# EAGLE design Maker Faire Machine Panel4 (Electron) (EAGLE 7.5.0)
DATABASE: /home/monkbroc/Electronics/eagle/PARTSDB.tsv
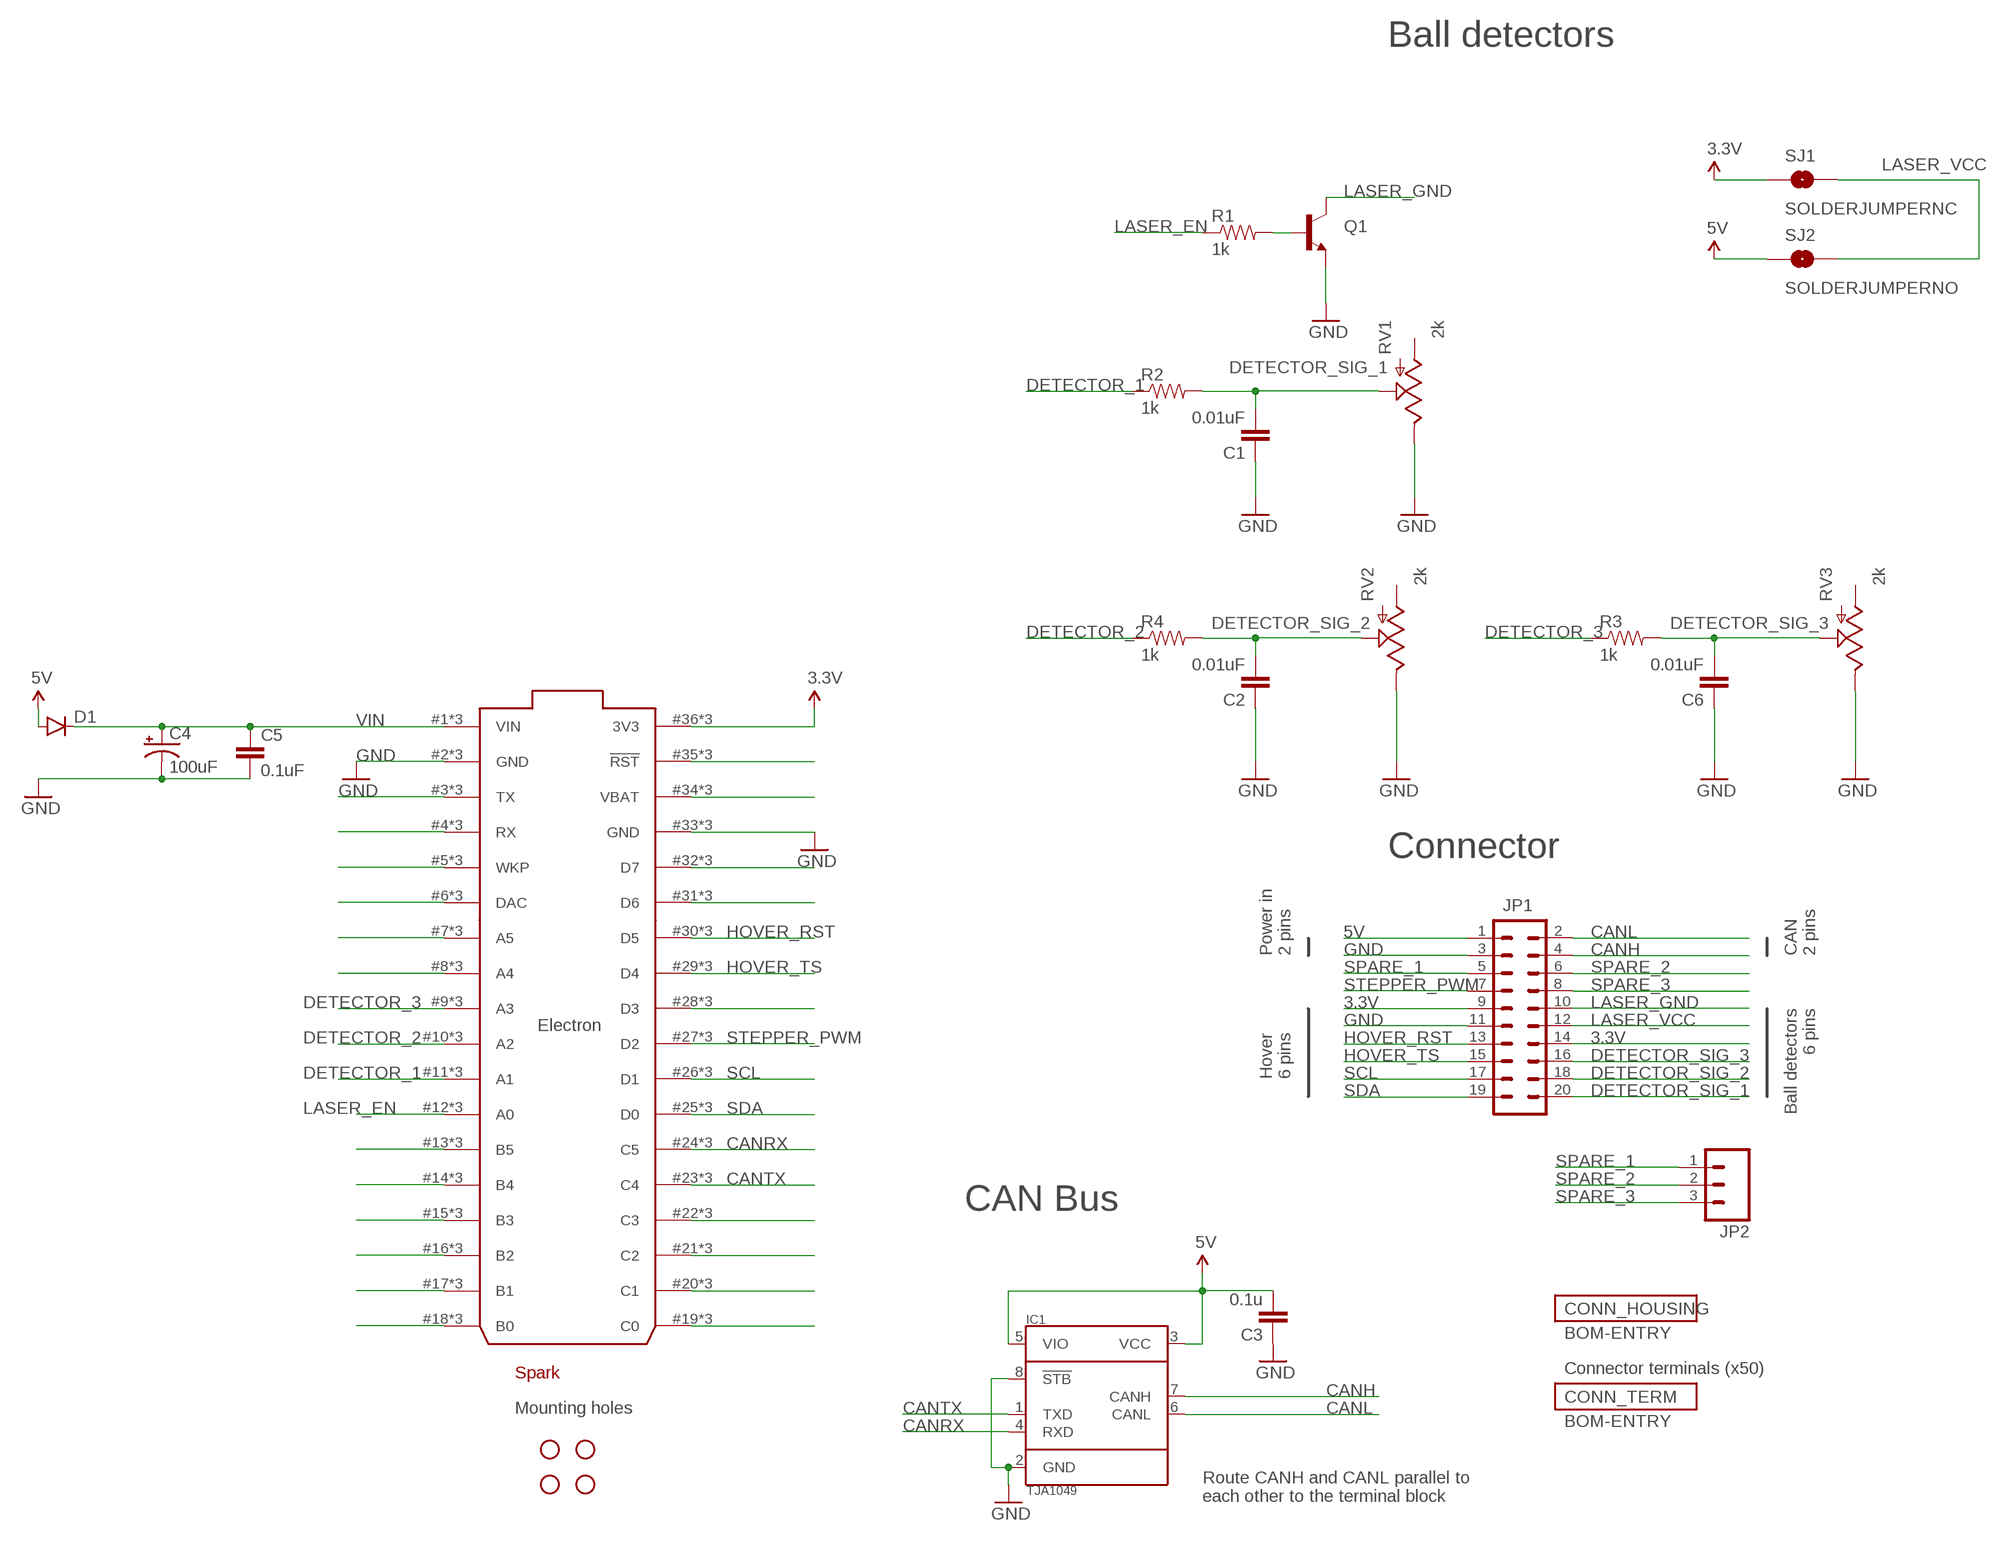
[diagram p0: schematic, sheet 1]
CONN_HOUSING (BOM-ENTRY): DESC: Connector housing; PARTNO: 334722001
CONN_TERM (BOM-ENTRY): DESC: Connector terminals (x50); PARTNO: 330122002

## Parts
C1  0.01uF  CAP1206  [1206]
C2  0.01uF  CAP1206  [1206]
C3  0.1u  CAP1206  [1206]
C4  100uF  CAP_POLPTH1  [CPOL-RADIAL-100UF-25V]
C5  0.1uF  CAP1206  [1206]
C6  0.01uF  CAP1206  [1206]
D1  DIODESMA  [SMA-DIODE]
ELECTRON  ELECTRON_WITH_STACKABLE_HEADERS  [ELECTRON_STACKABLE]
IC1  TJA1049  [SO8]
JP1  M10X2_MMOLEX_MX150  [2X10_MOLEX_MX150]
JP2  M031X03_NO_SILK  [1X03_NO_SILK]
Q1  TRANSISTOR_NPNTO-92-AMMO  [TO-92-AMMO]
R1  1k  RESISTOR1206  [1206]
R2  1k  RESISTOR1206  [1206]
R3  1k  RESISTOR1206  [1206]
R4  1k  RESISTOR1206  [1206]
RV1  2k  POT100K_3362U  [3362U]
RV2  2k  POT100K_3362U  [3362U]
RV3  2k  POT100K_3362U  [3362U]
SJ1  SOLDERJUMPERNC  [SJ_2S]
SJ2  SOLDERJUMPERNO  [SJ_2S-NO]
STANDOFF1  STAND-OFF  [STAND-OFF]
STANDOFF2  STAND-OFF  [STAND-OFF]
STANDOFF3  STAND-OFF  [STAND-OFF]
STANDOFF4  STAND-OFF  [STAND-OFF]
U$2  SPARK_LOGOSILK  [SPARK_LOGO_SILK]

## Nets
3.3V: ELECTRON.36(3V3) ELECTRON.#36(3V3) ELECTRON.@36(3V3) JP1.9 JP1.14 SJ1.1
5V: C3.2 D1.A IC1.3(VCC) IC1.5(VIO) JP1.1 SJ2.1
CANH: IC1.7(CANH) JP1.4
CANL: IC1.6(CANL) JP1.2
CANRX: ELECTRON.24(C5) ELECTRON.#24(C5) ELECTRON.@24(C5) IC1.4(RXD)
CANTX: ELECTRON.23(C4) ELECTRON.#23(C4) ELECTRON.@23(C4) IC1.1(TXD)
DETECTOR_1: ELECTRON.11(A1) ELECTRON.#11(A1) ELECTRON.@11(A1) R2.1
DETECTOR_2: ELECTRON.10(A2) ELECTRON.#10(A2) ELECTRON.@10(A2) R4.1
DETECTOR_3: ELECTRON.9(A3) ELECTRON.#9(A3) ELECTRON.@9(A3) R3.1
DETECTOR_SIG_1: C1.2 JP1.20 R2.2 RV1.P$2(S)
DETECTOR_SIG_2: C2.2 JP1.18 R4.2 RV2.P$2(S)
DETECTOR_SIG_3: C6.2 JP1.16 R3.2 RV3.P$2(S)
GND: C1.1 C2.1 C3.1 C4.2(-) C5.2 C6.1 ELECTRON.2(GND) ELECTRON.33(GND) ELECTRON.#2(GND) ELECTRON.#33(GND) ELECTRON.@2(GND) ELECTRON.@33(GND) IC1.2(GND) IC1.8(!STB) JP1.3 JP1.11 Q1.1(E) RV1.P$1(E) RV2.P$1(E) RV3.P$1(E)
HOVER_RST: ELECTRON.30(D5) ELECTRON.#30(D5) ELECTRON.@30(D5) JP1.13
HOVER_TS: ELECTRON.29(D4) ELECTRON.#29(D4) ELECTRON.@29(D4) JP1.15
LASER_EN: ELECTRON.12(A0) ELECTRON.#12(A0) ELECTRON.@12(A0) R1.1
LASER_GND: JP1.10 Q1.3(C)
LASER_VCC: JP1.12 SJ1.2 SJ2.2
N$1: ELECTRON.35(!RST) ELECTRON.#35(!RST) ELECTRON.@35(!RST)
N$2: ELECTRON.34(VBAT) ELECTRON.#34(VBAT) ELECTRON.@34(VBAT)
N$3: Q1.2(B) R1.2
N$5: ELECTRON.32(D7) ELECTRON.#32(D7) ELECTRON.@32(D7)
N$6: ELECTRON.31(D6) ELECTRON.#31(D6) ELECTRON.@31(D6)
N$7: ELECTRON.28(D3) ELECTRON.#28(D3) ELECTRON.@28(D3)
N$8: ELECTRON.8(A4) ELECTRON.#8(A4) ELECTRON.@8(A4)
N$9: ELECTRON.7(A5) ELECTRON.#7(A5) ELECTRON.@7(A5)
N$10: ELECTRON.6(DAC) ELECTRON.#6(DAC) ELECTRON.@6(DAC)
N$11: ELECTRON.5(WKP) ELECTRON.#5(WKP) ELECTRON.@5(WKP)
N$12: ELECTRON.4(RX) ELECTRON.#4(RX) ELECTRON.@4(RX)
N$13: ELECTRON.3(TX) ELECTRON.#3(TX) ELECTRON.@3(TX)
N$14: ELECTRON.22(C3) ELECTRON.#22(C3) ELECTRON.@22(C3)
N$15: ELECTRON.21(C2) ELECTRON.#21(C2) ELECTRON.@21(C2)
N$16: ELECTRON.20(C1) ELECTRON.#20(C1) ELECTRON.@20(C1)
N$17: ELECTRON.19(C0) ELECTRON.#19(C0) ELECTRON.@19(C0)
N$18: ELECTRON.18(B0) ELECTRON.#18(B0) ELECTRON.@18(B0)
N$19: ELECTRON.17(B1) ELECTRON.#17(B1) ELECTRON.@17(B1)
N$20: ELECTRON.16(B2) ELECTRON.#16(B2) ELECTRON.@16(B2)
N$21: ELECTRON.15(B3) ELECTRON.#15(B3) ELECTRON.@15(B3)
N$22: ELECTRON.14(B4) ELECTRON.#14(B4) ELECTRON.@14(B4)
N$23: ELECTRON.13(B5) ELECTRON.#13(B5) ELECTRON.@13(B5)
SCL: ELECTRON.26(D1) ELECTRON.#26(D1) ELECTRON.@26(D1) JP1.17
SDA: ELECTRON.25(D0) ELECTRON.#25(D0) ELECTRON.@25(D0) JP1.19
SPARE_1: JP1.5 JP2.1
SPARE_2: JP1.6 JP2.2
SPARE_3: JP1.8 JP2.3
STEPPER_PWM: ELECTRON.27(D2) ELECTRON.#27(D2) ELECTRON.@27(D2) JP1.7
VIN: C4.1(+) C5.1 D1.C ELECTRON.1(VIN) ELECTRON.#1(VIN) ELECTRON.@1(VIN)
Unconnected: RV1.P$3(A) RV2.P$3(A) RV3.P$3(A)

## Notes on the sheet
- Ball detectors
- Connector
- Power in
  2 pins
- CAN
  2 pins
- Ball detectors
  6 pins
- Hover
  6 pins
- CAN Bus
- Mounting holes
- Route CANH and CANL parallel to
  each other to the terminal block

## Library data of the parts
C1 C2 C6 = SparkFun-Passives:CAP: Capacitor Standard 0603 ceramic capacitor, and 0.1" leaded capacitor.; PARTNO: 12065C103KAT2A
C3 C5 = SparkFun-Capacitors:CAP: Capacitor Standard 0603 ceramic capacitor, and 0.1" leaded capacitor.; PARTNO: 12065C104KAT2A
C4 = SparkFun-Capacitors:CAP_POL: Capacitor Polarized These are standard SMD and PTH capacitors. Normally 10uF, 47uF, and 100uF in electrolytic and tantalum varieties. Always verify the external diameter of the through hole cap, it varies with capacity, voltage, and manufacturer. The EIA devices should be standard.; PARTNO: EEU-FM1H101B
D1 = SparkFun-DiscreteSemi:DIODE: Diode These are standard reverse protection diodes and small signal diodes. SMA package can handle up to about 1A. SOD-323 can handle about 200mA. What the SOD-323 package when ordering, there are some mfgs out there that are 5-pin packages.; PARTNO: B230A-13-F
ELECTRON = Particle-Devices:ELECTRON: Particle Electron footprint
IC1 = CAN:TJA1049; PARTNO: TJA1049T-118
JP1 = panel4:M10X2_M: 2x10 connector; PARTNO: 348302001
JP2 = SparkFun-Connectors:M03: Header 3 Standard 3-pin 0.1" header. Use with straight break away headers (SKU : PRT-00116), right angle break away headers (PRT-00553), swiss pins (PRT-00743), machine pins (PRT-00117), and female headers (PRT-00115). Molex polarized connector foot print use with SKU : PRT-08232 with associated crimp pins and housings.; DNP: T
Q1 = SparkFun-DiscreteSemi:TRANSISTOR_NPN: Generic NPN BJT MMBT2222A - TRANS-08049 (SOT-23, 1A 40V) MPSA42 - TRANS-09116 (SOT-23, 500mA 300V) MMBT5088LT1G - TRANS-11160 (SOT-23, 50 mA 30V) BC547 - COM-08928 <http://www.sparkfun.com/products/8928> (TO-92 45V 100mA) (1.Collector 2.Base 3.Emitter) 2N3904 - COM-00521 <http://www.sparkfun.com/products/521> (TO-92 40V 200mA) (1.Emitter 2.Base 3.Collector) P2N2222A - COM-12852 <http://www.sparkfun.com/products/12852> (TO-92 40V 600mA) (1.Collector 2.Base 3.Emitter); PARTNO: PN2222ABU
R1-R4 = SparkFun-Passives:RESISTOR: Resistor Basic schematic elements and footprints for 0603, 1206, and PTH resistors.; PARTNO: ERJ-8ENF1001V
RV1-RV3 = SparkFun-Electromechanical:POT; PARTNO: 3362U-1-202LF
SJ1 SJ2 = SparkFun-Retired:SOLDERJUMPER: Solder Jumper Standard SMD solder jumper. Used to automate production. Two varients : Normally Open and Normally Closed are the same, but have different paste layers. NC will have a large amount of paste and should jumper during reflow.; BOM: EXCLUDE
STANDOFF1-STANDOFF4 = SparkFun-Electromechanical:STAND-OFF: #4 Stand Off This is the mechanical footprint for a #4 phillips button head screw. Use the keepout ring to avoid running the screw head into surrounding components. SKU : PRT-00447; BOM: EXCLUDE
U$2 = Spark:SPARK_LOGO; BOM: EXCLUDE

## Board
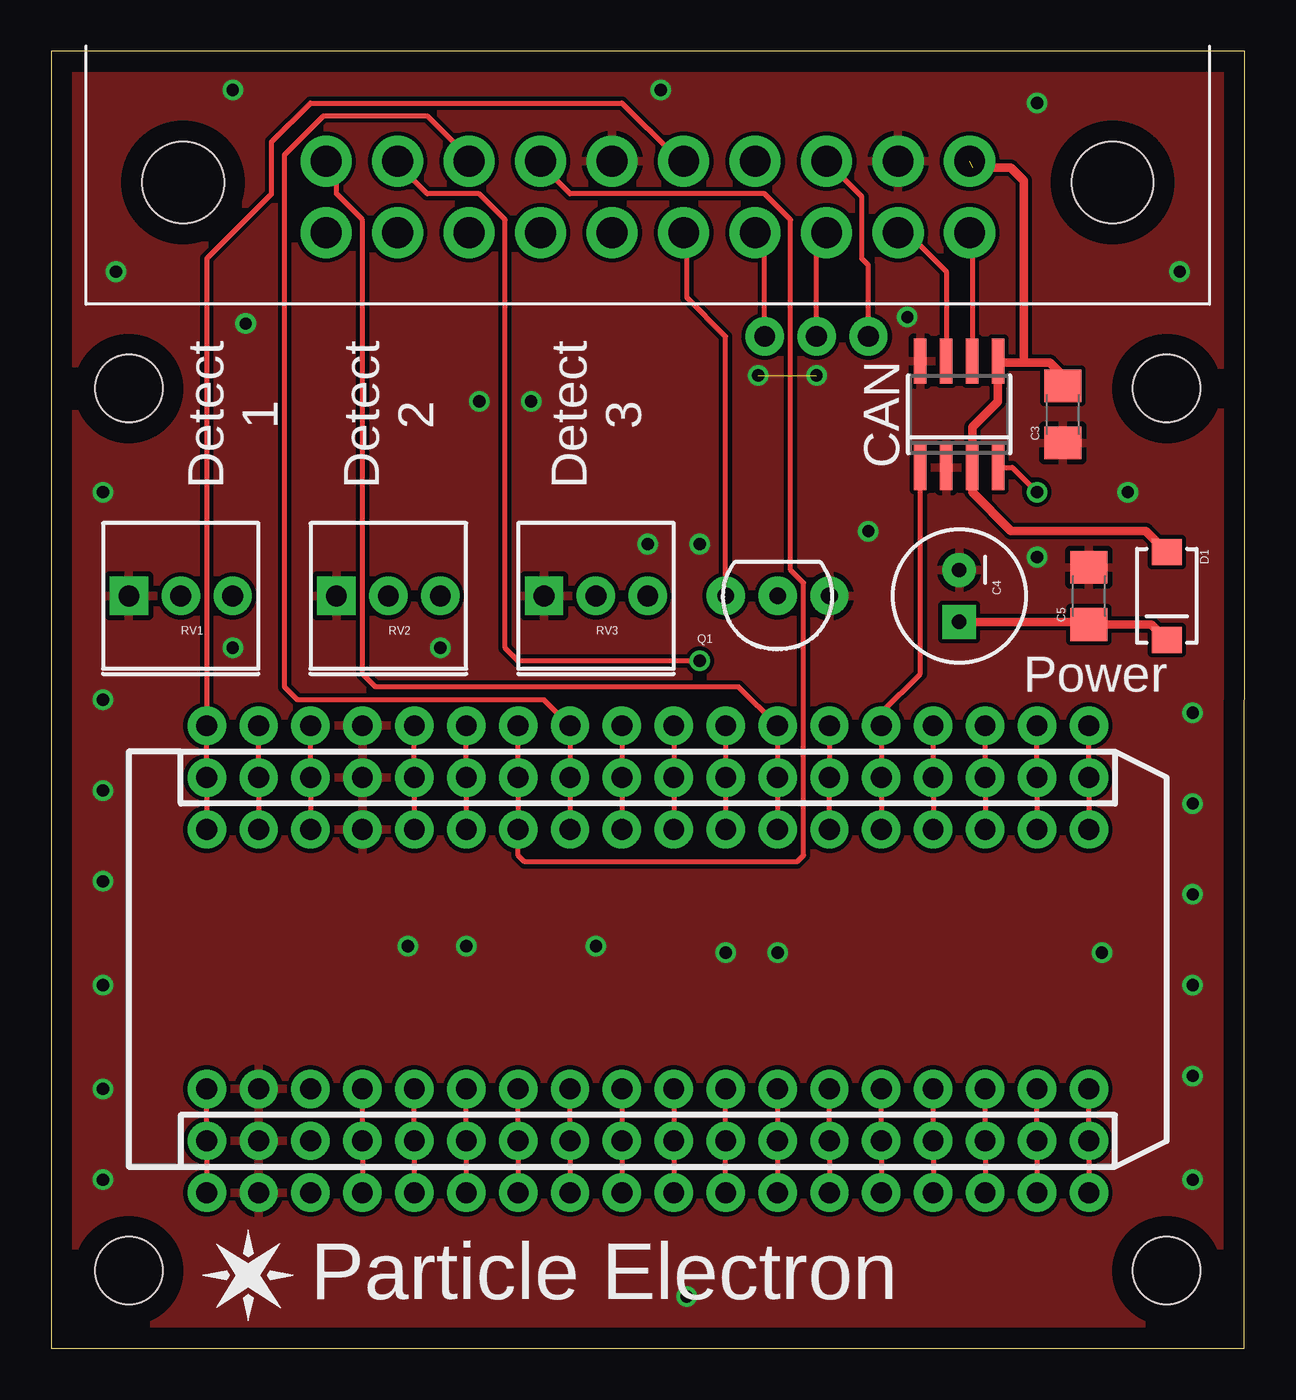
[diagram p1: board, top side]
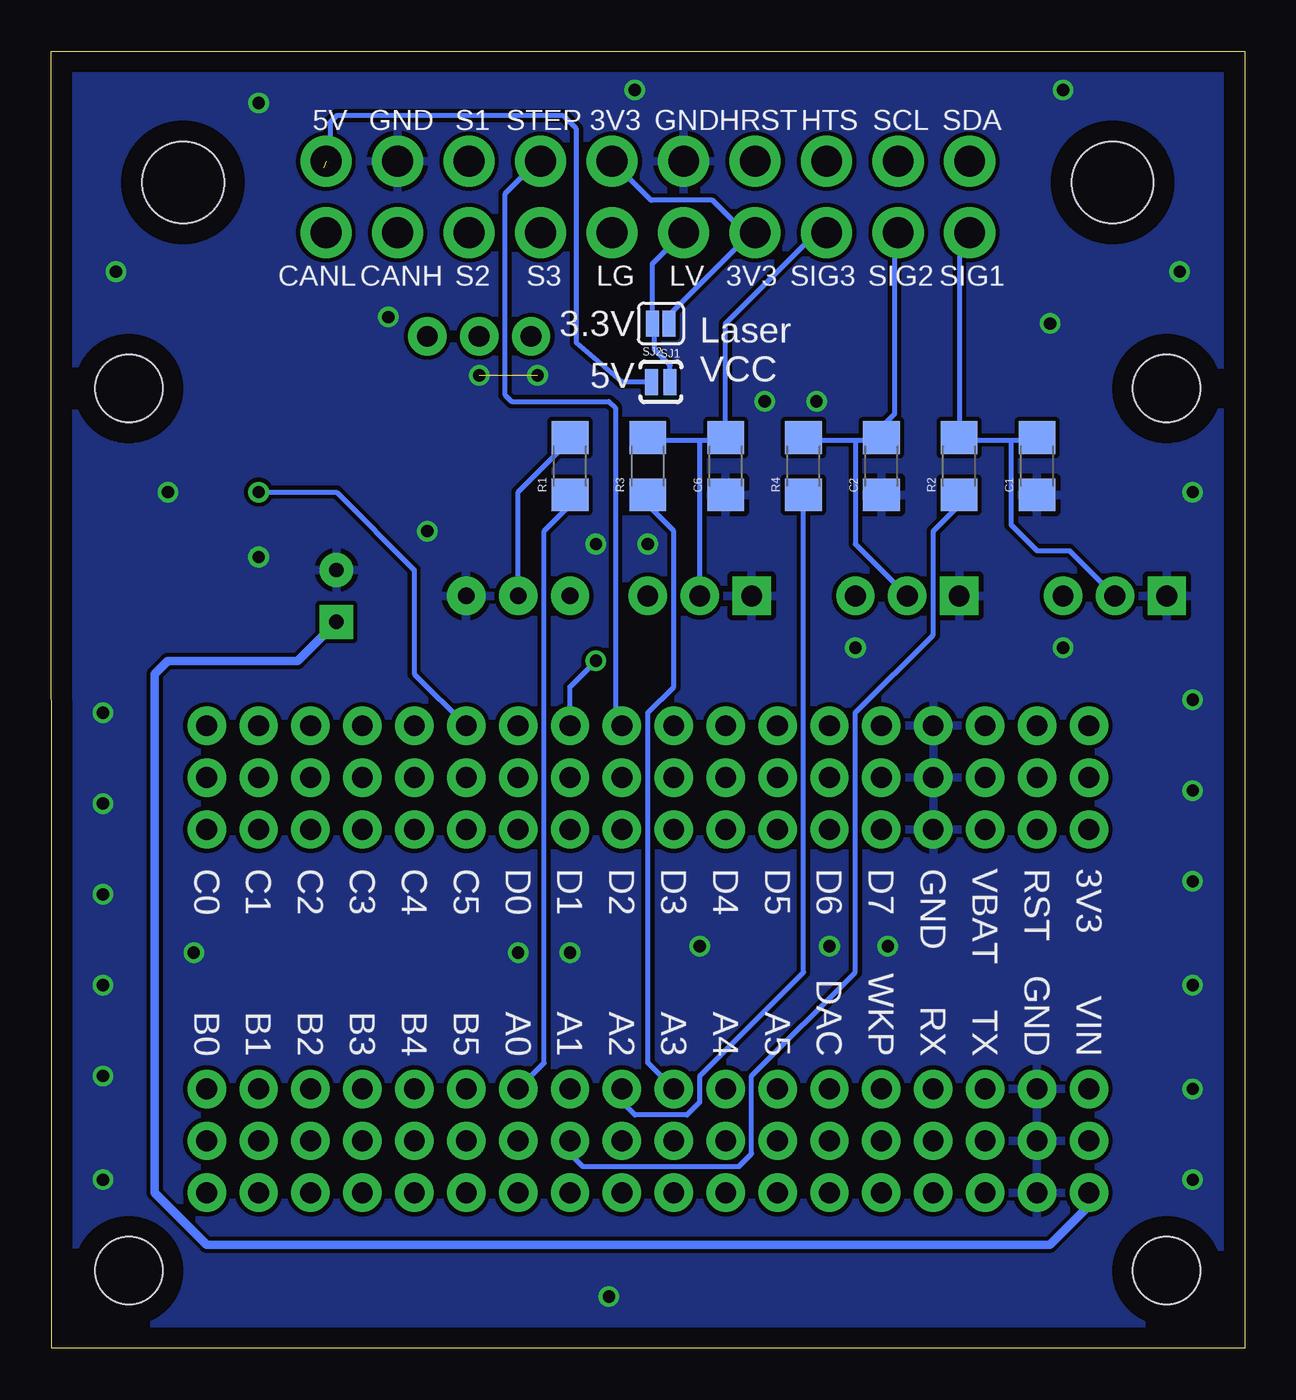
[diagram p2: board, bottom side, seen from below]

Size 58.42 x 63.5 mm. Coordinates in mm from the lower left corner, seen from the top.
Outline: 0,0 58.4,0 58.42,63.5 0,63.5 0,0
Copper layers (1*16): Top 0.035mm / dielectric 1.5mm / Bottom 0.035mm
Design rules "default": minimum track width 10mil, minimum drill 0.6mm, track to track 8mil, track to pad 8mil, pad to pad 8mil, via to via 8mil, smd to smd 8mil, copper to edge 40mil, drill to drill 8mil, minimum pad ring 10mil, minimum via ring 8mil, stop-mask expansion 4mil, vias tented up to drill 0mil, thermal gap 10mil

### Footprints (pad centres in the part's own frame; a part is rotated, then mirrored left to right if it is on the bottom)
1206 = smd 1.6 x 1.8: 1 -1.4,0; 2 1.4,0
CPOL-RADIAL-100UF-25V = drill 0.7 pad 1.651 square: 1 1.27,0 | drill 0.7 pad 1.651: 2 -1.27,0
SMA-DIODE = smd 1.27 x 1.47: A -2.15,0; C 2.15,0
ELECTRON_STACKABLE = drill 1.016 pad 1.88: 1 1.27,46.99; 2 1.27,44.45; 3 1.27,41.91; 4 1.27,39.37; 5 1.27,36.83; 6 1.27,34.29; 7 1.27,31.75; 8 1.27,29.21; 9 1.27,26.67; 10 1.27,24.13; 11 1.27,21.59; 12 1.27,19.05; 13 1.27,16.51; 14 1.27,13.97; 15 1.27,11.43; 16 1.27,8.89; 17 1.27,6.35; 18 1.27,3.81; 19 19.05,3.81; 20 19.05,6.35; 21 19.05,8.89; 22 19.05,11.43; 23 19.05,13.97; 24 19.05,16.51; 25 19.05,19.05; 26 19.05,21.59; 27 19.05,24.13; 28 19.05,26.67; 29 19.05,29.21; 30 19.05,31.75; 31 19.05,34.29; 32 19.05,36.83; 33 19.05,39.37; 34 19.05,41.91; 35 19.05,44.45; 36 19.05,46.99; #1 3.81,46.99; #2 3.81,44.45; #3 3.81,41.91; #4 3.81,39.37; #5 3.81,36.83; #6 3.81,34.29; #7 3.81,31.75; #8 3.81,29.21; #9 3.81,26.67; #10 3.81,24.13; #11 3.81,21.59; #12 3.81,19.05; #13 3.81,16.51; #14 3.81,13.97; #15 3.81,11.43; #16 3.81,8.89; #17 3.81,6.35; #18 3.81,3.81; #19 21.59,3.81; #20 21.59,6.35; #21 21.59,8.89; #22 21.59,11.43; #23 21.59,13.97; #24 21.59,16.51; #25 21.59,19.05; #26 21.59,21.59; #27 21.59,24.13; #28 21.59,26.67; #29 21.59,29.21; #30 21.59,31.75; #31 21.59,34.29; #32 21.59,36.83; #33 21.59,39.37; #34 21.59,41.91; #35 21.59,44.45; #36 21.59,46.99; @1 -1.27,46.99; @2 -1.27,44.45; @3 -1.27,41.91; @4 -1.27,39.37; @5 -1.27,36.83; @6 -1.27,34.29; @7 -1.27,31.75; @8 -1.27,29.21; @9 -1.27,26.67; @10 -1.27,24.13; @11 -1.27,21.59; @12 -1.27,19.05; @13 -1.27,16.51; @14 -1.27,13.97; @15 -1.27,11.43; @16 -1.27,8.89; @17 -1.27,6.35; @18 -1.27,3.81; @19 16.51,3.81; @20 16.51,6.35; @21 16.51,8.89; @22 16.51,11.43; @23 16.51,13.97; @24 16.51,16.51; @25 16.51,19.05; @26 16.51,21.59; @27 16.51,24.13; @28 16.51,26.67; @29 16.51,29.21; @30 16.51,31.75; @31 16.51,34.29; @32 16.51,36.83; @33 16.51,39.37; @34 16.51,41.91; @35 16.51,44.45; @36 16.51,46.99
SO8 = smd 0.6 x 2.2: 1 -1.905,-2.6; 2 -0.635,-2.6; 3 0.635,-2.6; 4 1.905,-2.6; 5 1.905,2.6; 6 0.635,2.6; 7 -0.635,2.6; 8 -1.905,2.6
2X10_MOLEX_MX150 = drill 1.5 pad 2.5: 1 -15.75,-3.5; 2 -15.75,0; 3 -12.25,-3.5; 4 -12.25,0; 5 -8.75,-3.5; 6 -8.75,0; 7 -5.25,-3.5; 8 -5.25,0; 9 -1.75,-3.5; 10 -1.75,0; 11 1.75,-3.5; 12 1.75,0; 13 5.25,-3.5; 14 5.25,0; 15 8.75,-3.5; 16 8.75,0; 17 12.25,-3.5; 18 12.25,0; 19 15.75,-3.5; 20 15.75,0 | hole 4: 22.75,-2.46; -22.75,-2.46
1X03_NO_SILK = drill 1.016 pad 1.88: 1 0,0; 2 2.54,0; 3 5.08,0
TO-92-AMMO = drill 0.813 pad 1.88: 1 -2.54,0; 2 0,0; 3 2.54,0
3362U = drill 1.016 pad 1.88 square: P$1 0,2.54 | drill 1.016 pad 1.88: P$2 2.54,2.54; P$3 5.08,2.54
SJ_2S = smd 0.635 x 1.27: 1 -0.412,0; 2 0.412,0
SJ_2S-NO = smd 0.635 x 1.27: 1 -0.45,0; 2 0.45,0
STAND-OFF = hole 3.302: 0,0

### Placement (x,y rotation side)
C1  10.16,43.18 90 bottom
C2  17.78,43.18 90 bottom
C3  49.53,45.72 90 top
C4  44.45,36.83 270 top
C5  50.8,36.83 90 top
C6  25.4,43.18 90 bottom
D1  54.61,36.83 270 top
ELECTRON  54.61,8.89 90 top
IC1  44.45,45.72 0 top
JP1  29.21,54.61 180 top
JP2  40.01,49.53 180 top
Q1  35.56,36.83 180 top
R1  33.02,43.18 90 bottom
R2  13.97,43.18 90 bottom
R3  29.21,43.18 90 bottom
R4  21.59,43.18 90 bottom
RV1  3.81,34.29 0 top
RV2  13.97,34.29 0 top
RV3  24.13,34.29 0 top
SJ1  28.57,50.16 180 bottom
SJ2  28.57,47.31 0 bottom
STANDOFF1  3.81,3.81 0 top
STANDOFF2  54.61,3.81 0 top
STANDOFF3  54.61,46.99 0 top
STANDOFF4  3.81,46.99 0 top
U$2  7.37,1.27 0 top

### Tracks (layer width: path | path; a pad name or v marks a point on that pad's centre or on a via)
3.3V
  Top 0.254: ELECTRON.@36 ELECTRON.36 ELECTRON.#36 7.62,53.34 10.79,56.52 10.79,59.05 12.7,60.96 27.94,60.96 30.48,58.42 JP1.9
  Bottom 0.254: 24.13,54.61 28.16,50.58 SJ1.1 | 24.13,54.61 JP1.14 | 24.13,54.61 24.45,54.61 26.04,56.2 29.05,56.2 JP1.9
5V  (1 unrouted)
  Top 0.254: 49.53,47.62 C3.2
  Top 0.406: 45.09,57.78 46.99,57.78 47.62,57.15 47.62,48.26 | 47.62,48.26 48.9,48.26 49.53,47.62 | 47.62,48.26 46.41,48.26 IC1.5 46.35,46.35 45.09,45.09 IC1.3 45.09,41.91 46.99,40.01 53.59,40.01 D1.A
  Bottom 0.254: SJ2.1 30.48,47.31 32.7,49.21 32.7,59.69 33.34,60.33 44.45,60.33 44.77,60.01 44.77,58.3 JP1.1
CANH
  Top 0.254: JP1.4 41.91,54.61 43.81,52.7 IC1.7
CANL
  Top 0.254: IC1.6 45.09,54.61 JP1.2
CANRX  (via drill 0.6)
  Top 0.254: ELECTRON.#24 ELECTRON.24 ELECTRON.@24 | IC1.4 47.05,43.12 v48.26,41.91
  Bottom 0.254: v48.26,41.91 44.45,41.91 40.64,38.1 40.64,33.02 ELECTRON.#24
CANTX
  Top 0.254: ELECTRON.@23 ELECTRON.23 ELECTRON.#23 40.64,31.11 42.55,33.02 IC1.1
DETECTOR_1
  Top 0.254: ELECTRON.#11 ELECTRON.11 ELECTRON.@11
  Bottom 0.254: R2.1 13.97,41.27 15.24,40.01 15.24,34.92 19.05,31.11 19.05,18.41 24.13,13.34 24.13,9.53 24.77,8.89 32.38,8.89 33.02,9.53 ELECTRON.11
DETECTOR_2
  Top 0.254: ELECTRON.@10 ELECTRON.10 ELECTRON.#10
  Bottom 0.254: R4.1 21.59,18.41 26.67,13.34 26.67,12.06 27.3,11.43 29.84,11.43 30.48,12.06 ELECTRON.#10
DETECTOR_3
  Top 0.254: ELECTRON.@9 ELECTRON.9 ELECTRON.#9
  Bottom 0.254: ELECTRON.#9 29.21,13.97 29.21,31.11 27.94,32.38 27.94,40.01 29.21,41.27 R3.1
DETECTOR_SIG_1
  Bottom 0.254: 11.43,44.45 13.97,44.45 R2.2 13.97,54.61 JP1.20 | 11.43,44.45 10.16,44.45 C1.2 | 11.43,44.45 11.43,40.32 10.16,39.05 8.57,39.05 RV1.P$2
DETECTOR_SIG_2
  Bottom 0.254: 19.05,44.45 21.59,44.45 R4.2 | 19.05,44.45 17.78,44.45 C2.2 17.78,45.09 17.14,45.72 17.14,54.61 JP1.18 | RV2.P$2 19.05,39.37 19.05,44.45
DETECTOR_SIG_3
  Bottom 0.254: 26.67,44.45 29.21,44.45 R3.2 | 26.67,44.45 25.4,44.45 C6.2 25.4,50.16 20.95,54.61 JP1.16 | RV3.P$2 26.67,44.45
GND  (via drill 0.6)  (1 unrouted)
  other vias: 2.54,8.26 2.54,12.7 2.54,17.78 2.54,22.86 2.54,27.3 2.54,31.75 2.54,41.91 9.53,50.16 8.89,34.29 19.05,34.29 20.95,46.35 23.5,46.35 40.01,40.01 31.75,39.37 29.21,39.37 48.26,38.73 52.7,41.91 55.88,31.11 33.02,19.37 26.67,19.68 20.32,19.68 17.46,19.68 35.56,19.37 51.44,19.37 55.88,22.23 55.88,26.67 55.88,17.78 55.88,13.34 55.88,8.26 31.11,2.54 48.26,60.96 55.24,52.7 41.91,50.48 34.61,47.62 29.84,61.59 8.89,61.59 3.17,52.7 37.47,47.62
  pour Top: 0,63.5 58.42,63.5 58.42,0 0,0
  pour Bottom: 0,63.5 58.42,63.5 58.42,0 0,0
HOVER_RST
  Top 0.254: ELECTRON.#30 ELECTRON.30 ELECTRON.@30 22.86,24.13 23.18,23.81 36.51,23.81 36.83,24.13 36.83,37.47 36.2,38.1 36.2,55.24 34.92,56.52 25.4,56.52 24.13,57.78 JP1.13
HOVER_TS
  Top 0.254: ELECTRON.@29 ELECTRON.29 ELECTRON.#29 24.13,31.75 12.06,31.75 11.43,32.38 11.43,58.42 13.34,60.33 18.41,60.33 20.32,58.42 JP1.15
LASER_EN
  Top 0.254: ELECTRON.@12 ELECTRON.12 ELECTRON.#12
  Bottom 0.254: ELECTRON.#12 34.29,13.97 34.29,40.01 33.02,41.27 R1.1
LASER_GND
  Top 0.254: Q1.3 33.02,49.53 31.11,51.44 31.11,54.45 JP1.10
LASER_VCC
  Bottom 0.254: SJ2.2 28.12,48.13 28.89,48.9 28.89,50.07 SJ1.2 28.99,53.08 JP1.12
N$1
  Top 0.254: ELECTRON.@35 ELECTRON.35 ELECTRON.#35
N$2
  Top 0.254: ELECTRON.@34 ELECTRON.34 ELECTRON.#34
N$3
  Bottom 0.254: Q1.2 35.56,41.91 33.02,44.45 R1.2
N$5
  Top 0.254: ELECTRON.@32 ELECTRON.32 ELECTRON.#32
N$6
  Top 0.254: ELECTRON.@31 ELECTRON.31 ELECTRON.#31
N$7
  Top 0.254: ELECTRON.@28 ELECTRON.28 ELECTRON.#28
N$8
  Top 0.254: ELECTRON.@8 ELECTRON.8 ELECTRON.#8
N$9
  Top 0.254: ELECTRON.@7 ELECTRON.7 ELECTRON.#7
N$10
  Top 0.254: ELECTRON.@6 ELECTRON.6 ELECTRON.#6
N$11
  Top 0.254: ELECTRON.@5 ELECTRON.5 ELECTRON.#5
N$12
  Top 0.254: ELECTRON.@4 ELECTRON.4 ELECTRON.#4
N$14
  Top 0.254: ELECTRON.@22 ELECTRON.22 ELECTRON.#22
N$15
  Top 0.254: ELECTRON.@21 ELECTRON.21 ELECTRON.#21
N$16
  Top 0.254: ELECTRON.@20 ELECTRON.20 ELECTRON.#20
N$17
  Top 0.254: ELECTRON.@19 ELECTRON.19 ELECTRON.#19
N$18
  Top 0.254: ELECTRON.@18 ELECTRON.18 ELECTRON.#18
N$19
  Top 0.254: ELECTRON.@17 ELECTRON.17 ELECTRON.#17
N$20
  Top 0.254: ELECTRON.@16 ELECTRON.16 ELECTRON.#16
N$21
  Top 0.254: ELECTRON.@15 ELECTRON.15 ELECTRON.#15
N$22
  Top 0.254: ELECTRON.@14 ELECTRON.14 ELECTRON.#14
N$23
  Top 0.254: ELECTRON.@13 ELECTRON.13 ELECTRON.#13
SCL  (via drill 0.6)
  Top 0.254: ELECTRON.@26 ELECTRON.26 ELECTRON.#26 | v31.75,33.66 22.86,33.66 22.23,34.29 22.23,55.24 20.95,56.52 18.41,56.52 17.14,57.78 JP1.17
  Bottom 0.254: v31.75,33.66 33.02,32.38 ELECTRON.#26
SDA
  Top 0.254: ELECTRON.@25 ELECTRON.25 ELECTRON.#25 33.66,32.38 15.88,32.38 15.24,33.02 15.24,55.24 13.97,56.52 13.97,57.78 JP1.19
SPARE_1
  Top 0.254: JP2.1 40.01,53.02 39.69,53.34 39.69,56.38 JP1.5
SPARE_2
  Top 0.254: JP1.6 37.47,54.12 JP2.2
SPARE_3
  Top 0.254: JP1.8 34.92,54.15 JP2.3
STEPPER_PWM
  Top 0.254: ELECTRON.@27 ELECTRON.27 ELECTRON.#27
  Bottom 0.254: JP1.7 34.92,57.78 36.2,56.52 36.2,46.67 35.88,46.35 31.11,46.35 30.8,46.04 30.8,30.8 ELECTRON.#27
VIN
  Top 0.254: ELECTRON.@1 ELECTRON.1 ELECTRON.#1
  Top 0.406: D1.C 53.86,35.43 C5.1 50.67,35.56 C4.1
  Bottom 0.406: C4.1 46.35,33.66 52.7,33.66 53.34,33.02 53.34,7.62 50.8,5.08 9.53,5.08 7.62,6.99 ELECTRON.@1

### Text on the board
tPlace: Detect / 1 | Detect / 2 | Detect / 3 | CAN | Power | Particle Electron
bPlace: SDA | SCL | HTS | HRST | GND | 3V3 | STEP | S1 | GND | 5V | SIG1 | SIG2 | SIG3 | 3V3 | LV | LG | S3 | S2 | CANH | CANL | 3.3V | Laser / VCC | 5V | 3V3 / RST / VBAT / GND / D7 / D6 / D5 / D4 / D3 / D2 / D1 / D0 / C5 / C4 / C3 / C2 / C1 / C0 | VIN / GND / TX / RX / WKP / DAC / A5 / A4 / A3 / A2 / A1 / A0 / B5 / B4 / B3 / B2 / B1 / B0